# EAGLE design opbouw (EAGLE 6.3)
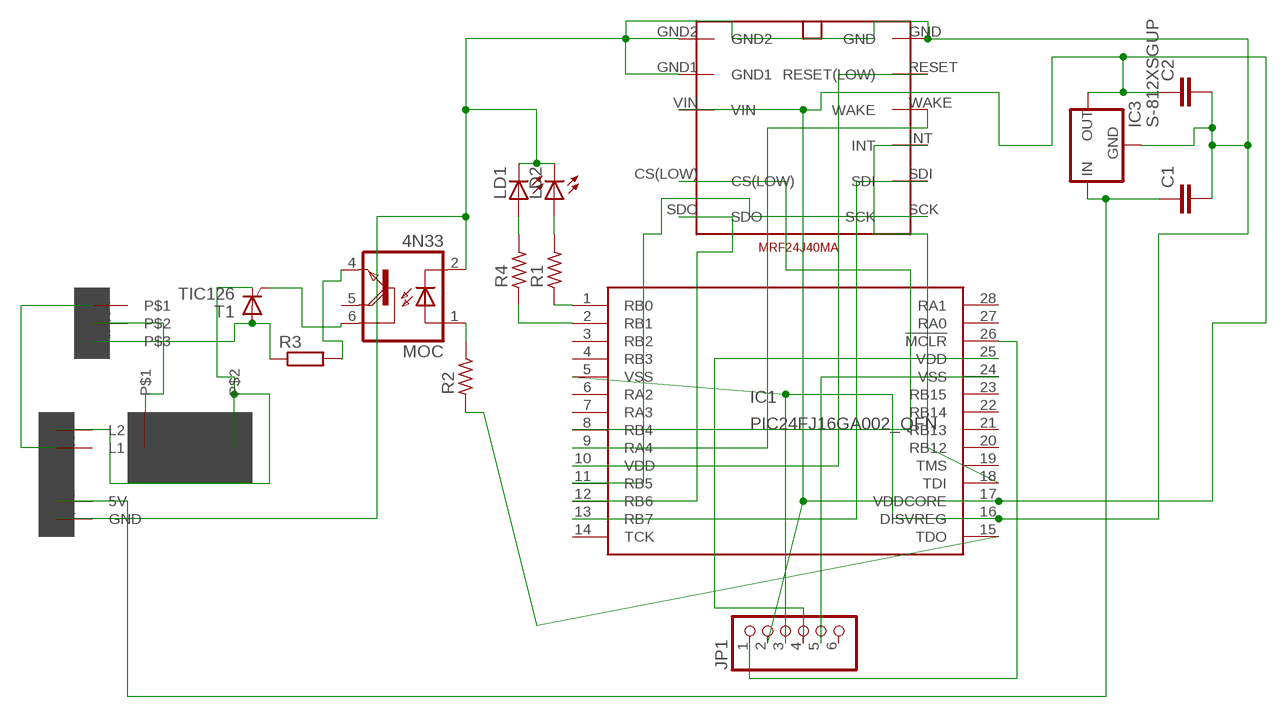
[diagram p0: schematic, sheet 1]

## Parts
C1  C-EUC0805K  [C0805K]
C2  C-EUC0805K  [C0805K]
IC1  PIC24FJ16GA002_QFN  [QFN28-ML_6X6MM]
IC3  S-812XSGUP  [SOT89]
JP1  PINHD-1X6  [1X06]
LD1  LEDCHIPLED_0805  [CHIPLED_0805]
LD2  LEDCHIPLED_0805  [CHIPLED_0805]
MOC  4N33  [DIL06]
R1  R_0805  [R0805]
R2  R_0805  [R0805]
R3  R-EU_0207/10  [0207/10]
R4  R_0805  [R0805]
T1  TIC126  [TO220CS]
U$1  MRF24J40MA  [MRF24J40MA]
U$2  CONNECTOR  [CONNECTOR]
U$3  FUSEFUSE  [FUSE]
U$4  BIAS  [BIAS]

## Nets
N$1: C2.1 IC1.17(VDDCORE) IC3.3(OUT) JP1.2 U$1.VIN
N$3: IC1.26(!MCLR) JP1.1
N$4: IC1.25(VDD) JP1.4
N$5: IC1.24(VSS) JP1.5
N$6: IC1.8(RB4) U$1.CS(LOW)
N$7: IC1.15(TDO) R2.1
N$8: IC1.10(VDD) U$1.RESET(RESET(LOW))
N$9: IC1.13(RB7) U$1.SDI
N$10: IC1.18(TDI) U$1.INT
N$11: IC1.9(RA4) U$1.WAKE
N$12: IC1.11(RB5) U$1.SCK
N$13: MOC.6(B) T1.G
N$14: MOC.1(A) R2.2
N$15: IC1.12(RB6) U$1.SDO
N$16: MOC.4(E) R3.2
N$17: U$2.P$2 U$3.P$1
N$18: R3.1 T1.A U$2.P$3
N$21: IC1.1(RB0) R1.1
N$22: IC1.2(RB1) R4.1
N$23: LD2.A R1.2
N$24: LD1.A R4.2
N$25: C1.2 C2.2 IC1.5(VSS) IC1.16(DISVREG) IC3.1(GND) JP1.3 LD1.C LD2.C MOC.2(C) U$1.GND U$1.GND1 U$1.GND2 U$4.P$4(GND)
N$28: C1.1 IC3.2(IN) U$4.P$3(5V)
N$32: T1.C U$3.P$2 U$4.P$1(L2)
N$34: U$2.P$1 U$4.P$2(L1)
Unconnected: IC1.3(RB2) IC1.4(RB3) IC1.6(RA2) IC1.7(RA3) IC1.14(TCK) IC1.19(TMS) IC1.20(RB12) IC1.21(RB13) IC1.22(RB14) IC1.23(RB15) IC1.27(RA0) IC1.28(RA1) JP1.6 MOC.5(COL)

## Library data of the parts
C1 C2 = rcl 2:C-EU: CAPACITOR, European symbol
IC1 = microchip:PIC24FJ16GA002_QFN: PIC24FJ16GA002_QFN edit this description Auto generated by make-symbol-device-package-bsdl.ulp Rev. 25 Source: PIC24FJ16GA002_QFN.bsd; MPN: PIC24FJ16GA002-I/ML; OC_FARNELL: unknown; OC_NEWARK: 40M1425
IC3 = v-reg-3:S-812XSG: Low power, low dropout positive regulator
JP1 = pinhead 2:PINHD-1X6: PIN HEADER
LD1 LD2 = led 2:LED: LED OSRAM: - CHIPLED LG R971, LG N971, LY N971, LG Q971, LY Q971, LO R971, LY R971 LH N974, LH R974 LS Q976, LO Q976, LY Q976 LO Q996 - Hyper CHIPLED LW Q18S LB Q993, LB Q99A, LB R99A - SideLED LS A670, LO A670, LY A670, LG A670, LP A670 LB A673, LV A673, LT A673, LW A673 LH A674 LY A675 LS A676, LA A676, LO A676, LY A676, LW A676 LS A679, LY A679, LG A679 - Hyper Micro SIDELED® LS Y876, LA Y876, LO Y876, LY Y876 LT Y87S - SmartLED LW L88C, LW L88S LB L89C, LB L89S, LG L890 LS L89K, LO L89K, LY L89K LS L896, LA L896, LO L896, LY L896 - TOPLED LS T670, LO T670, LY T670, LG T670, LP T670 LSG T670, LSP T670, LSY T670, LOP T670, LYG T670 LG T671, LOG T671, LSG T671 LB T673, LV T673, LT T673, LW T673 LH T674 LS T676, LA T676, LO T676, LY T676, LB T676, LH T676, LSB T676, LW T676 LB T67C, LV T67C, LT T67C, LS T67K, LO T67K, LY T67K, LW E67C LS E67B, LA E67B, LO E67B, LY E67B, LB E67C, LV E67C, LT E67C LW T67C LS T679, LY T679, LG T679 LS T770, LO T770, LY T770, LG T770, LP T770 LB T773, LV T773, LT T773, LW T773 LH T774 LS E675, LA E675, LY E675, LS T675 LS T776, LA T776, LO T776, LY T776, LB T776 LHGB T686 LT T68C, LB T68C - Hyper Mini TOPLED® LB M676 - Mini TOPLED Santana® LG M470 LS M47K, LO M47K, LY M47K Source: http://www.osram.convergy.de/
MOC = optocoupler:4N33: MOTOROLA OPTO COUPLER; MF: VISHAY/TELEFUNKEN; MPN: 4N33; OC_FARNELL: 1469601; OC_NEWARK: 88K1390
R1 R2 R4 = rc-master:R_: RESISTOR
R3 = rcl 2:R-EU_: RESISTOR, European symbol
T1 = triggered_devices:TIC126: THYRISTOR
U$1 = MRF24J40MA:MRF24J40MA
U$2 = connector7.5mm:CONNECTOR: connector 7.5mm
U$3 = fuse:FUSE
U$4 = bias:BIAS

## Board
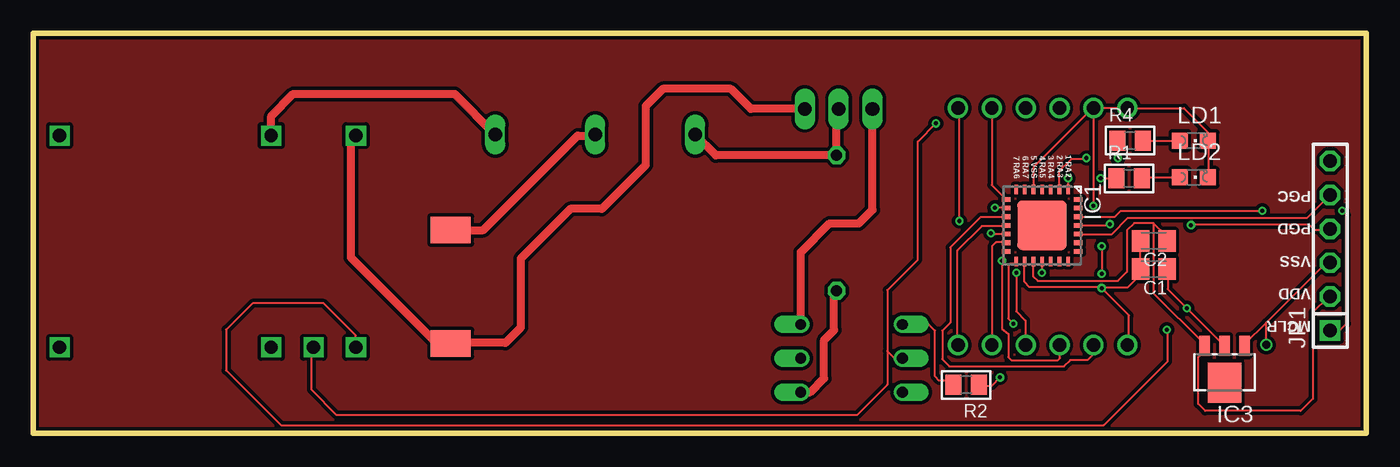
[diagram p1: board, top side]
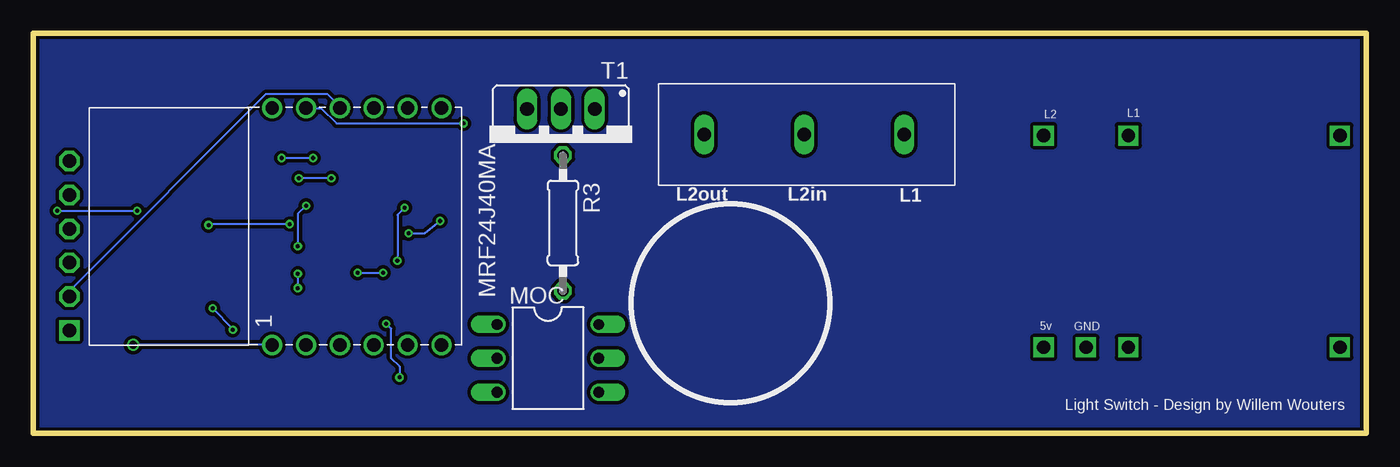
[diagram p2: board, bottom side, seen from below]

Size 100 x 30 mm. Coordinates in mm from the lower left corner, seen from the top.
Outline: 0,0 0,30 100,30 100,0 0,0
Copper layers (1*16): Top 0.035mm / dielectric 1.5mm / Bottom 0.035mm
Design rules "ITEADstudio_DRC": minimum track width 6mil, minimum drill 12mil, track to track 6mil, track to pad 6mil, pad to pad 6mil, via to via 6mil, smd to smd 0mil, copper to edge 10mil, drill to drill 10mil, minimum pad ring 10mil, minimum via ring 6mil, stop-mask expansion 2mil, vias tented up to drill 100mil, thermal gap 10mil

### Footprints (pad centres in the part's own frame; a part is rotated, then mirrored left to right if it is on the bottom)
C0805K = smd 1.3 x 1.6: 1 -1,0; 2 1,0
QFN28-ML_6X6MM = smd 0.7 x 0.35: 1 -2.7,1.95; 2 -2.7,1.3; 3 -2.7,0.65; 4 -2.7,0; 5 -2.7,-0.65; 6 -2.7,-1.3; 7 -2.7,-1.95; 15 2.7,-1.95; 16 2.7,-1.3; 17 2.7,-0.65; 18 2.7,0; 19 2.7,0.65; 20 2.7,1.3; 21 2.7,1.95 | smd 0.35 x 0.7: 8 -1.95,-2.7; 9 -1.3,-2.7; 10 -0.65,-2.7; 11 0,-2.7; 12 0.65,-2.7; 13 1.3,-2.7; 14 1.95,-2.7; 22 1.95,2.7; 23 1.3,2.7; 24 0.65,2.7; 25 0,2.7; 26 -0.65,2.7; 27 -1.3,2.7; 28 -1.95,2.7 | smd 3.7 x 3.7: EXP 0,0
SOT89 = smd 0.8 x 1.5: 1 -1.5,-1.75; 2 0,-1.75; 3 1.5,-1.75 | smd 2.5 x 3: 4 0,1.05
1X06 = drill 1.016 square: 1 -6.35,0 | drill 1.016 octagon: 2 -3.81,0; 3 -1.27,0; 4 1.27,0; 5 3.81,0; 6 6.35,0
CHIPLED_0805 = smd 1.2 x 1.2: A 0,-1.05; C 0,1.05
DIL06 = drill 0.813 offset: 1 -2.54,-3.81; 2 0,-3.81; 3 2.54,-3.81; 4 2.54,3.81; 5 0,3.81; 6 -2.54,3.81
R0805 = smd 1.2 x 1.5: 1 -0.953,0; 2 0.953,0
0207/10 = drill 0.813 octagon: 1 -5.08,0; 2 5.08,0
TO220CS = drill 1.016 long: A 0,-2.54; C -2.54,-2.54; G 2.54,-2.54
MRF24J40MA = drill 1: CS(LOW) 16.764,4.064; GND -1.016,14.224; GND1 16.764,11.684; GND2 16.764,14.224; INT -1.016,6.604; NC 16.764,6.604; RESET -1.016,11.684; SCK -1.016,1.524; SDI -1.016,4.064; SDO 16.764,1.524; VIN 16.764,9.144; WAKE -1.016,9.144
CONNECTOR = drill 1 long: P$1 0,0; P$2 7.5,0; P$3 15,0
FUSE = smd 2 x 3: P$1 -1,0; P$2 7.5,0
BIAS = drill 1 square: P$1 22.225,0; P$2 15.875,0; P$3 22.225,15.875; P$4 19.05,15.875; P$5 15.875,15.875; P$8 0,15.875; P$99 0,0

### Placement (x,y rotation side)
C1  84.06,12.31 180 top
C2  84.06,14.43 180 top
IC1  75.68,15.6 270 top
IC3  89.36,4.84 180 top
JP1  97.3,14.07 90 top
LD1  87.09,21.95 270 top
LD2  87.09,19.2 270 top
MOC  61.38,5.63 270 bottom
R1  82.21,19.13 0 top
R2  70,3.63 180 top
R3  60.26,15.77 270 bottom
R4  82.29,21.95 0 top
T1  60.42,21.79 180 bottom
U$1  67.85,7.64 90 bottom
U$2  34.66,22.4 0 top
U$3  31.31,14.25 270 top
U$4  1.97,22.33 180 bottom

### Tracks (layer width: path | path; a pad name or v marks a point on that pad's centre or on a via)
N$1
  Top 0.152: 84.04,15.77 82.59,15.77 82.06,15.24 82.06,12.12 81.37,11.43 75.35,11.43 75.05,11.73 75.05,12.8 IC1.17 | 84.04,15.77 84.95,14.86 C2.1 | 84.04,15.77 84.04,10.52 87.85,6.71 IC3.3 | 87.85,6.55 IC3.3 | JP1.2 97.15,10.21 96,9.07 96,2.59 95.09,1.68 87.92,1.68 87.39,2.21 87.39,5.71 87.77,6.1 87.77,6.5 IC3.3
  Bottom 0.152: U$1.VIN 77.03,24.54 77.94,25.45 82.52,25.45 97.15,10.82 97.15,10.36 JP1.2
N$3  (via drill 0.3)
  Top 0.152: IC1.26 78.4,16.23 81.14,16.23 81.6,16.69 92.27,16.69 92.19,16.61 v92.19,16.69 | v98.21,16.69 98.52,16.38 98.52,8.23 97.98,7.7 97.37,7.7 97.3,7.77 JP1.1
  Bottom 0.152: v98.21,16.69 v92.19,16.69
N$4  (via drill 0.3)
  Top 0.152: v86.86,15.62 86.86,15.7 95.7,15.7 96.16,15.24 97.3,15.24 97.3,15.32 JP1.4 | v80.76,15.7 80.53,15.62 78.4,15.62 IC1.25
  Bottom 0.152: v86.86,15.62 86.94,15.7 v80.76,15.7
N$5
  Top 0.152: IC1.24 80.92,14.95 82.13,16.15 95.57,16.15 JP1.5
N$6
  Top 0.152: U$1.CS(LOW) 71.92,18.61 IC1.8
N$7  (via drill 0.3)
  Top 0.152: v72.53,4.19 71.92,3.58 70.7,3.58 | v73.52,8.23 73.14,8.61 73.14,12.57 73.3,12.72 73.68,12.72 73.75,12.88 IC1.15 | 70.7,3.58 70.55,3.58 | 70.7,3.58 R2.1
  Bottom 0.152: v72.53,4.19 72.53,5.03 73.14,5.64 73.14,7.85 v73.52,8.23
N$8
  Top 0.152: 79.54,6.55 U$1.RESET 79.47,6.55 79.47,5.87 79.09,5.49 77.79,5.49 77.33,5.03 68.72,5.03 68.19,5.56 68.19,7.7 68.8,8.31 68.8,13.95 71.08,16.23 72.97,16.23 IC1.10 72.91,16.23
N$9
  Top 0.152: U$1.SDI 71.92,7.77 71.92,14.02 72.23,14.33 72.84,14.33 IC1.13
N$10  (via drill 0.3)
  Top 0.152: v73.75,12.04 73.75,9.14 74.44,8.46 74.44,6.64 U$1.INT | 75.66,12.8 v75.66,12.04
  Top 0.254: 75.66,12.8 IC1.18
  Bottom 0.152: v75.66,12.04 v73.75,12.04
N$11  (via drill 0.3)
  Top 0.152: v72.69,12.95 72.69,7.85 73.14,7.47 73.14,5.71 73.37,5.49 76.88,5.49 77.03,5.64 77.03,6.55 U$1.WAKE | v72.15,16.92 72.91,16.92 IC1.9
  Bottom 0.152: v72.69,12.95 72.69,16.38 v72.15,16.92
N$12
  Top 0.152: U$1.SCK 69.33,7.09 69.33,13.72 71.16,15.54 72.84,15.54 IC1.11
N$13
  Top 0.61: MOC.6 57.58,13.59 59.73,15.75 61.94,15.75 62.96,16.76 T1.G
N$14
  Top 0.152: R2.2 68.95,3.5 68.72,3.96 67.96,3.96 67.66,4.27 67.66,7.7 67.12,8.23 65.21,8.23 MOC.1
N$15  (via drill 0.3)
  Top 0.152: v71.85,15.01 71.92,14.94 72.91,14.94 IC1.12 | 69.41,24.38 U$1.SDO 69.48,24.3 v69.48,15.93
  Bottom 0.152: v69.48,15.93 70.63,15.01 v71.85,15.01
N$16
  Top 0.61: MOC.4 58.3,3.09 59.33,4.12 59.33,6.99 60.09,7.75 60.09,10.44 R3.2
N$17
  Top 0.61: U$3.P$1 33.76,15.25 40.83,22.33 42.09,22.33 U$2.P$2
N$18
  Top 0.61: T1.A 60.27,24.18 R3.1 51.21,20.85 U$2.P$3
N$20
  pour Bottom (isolate 0.254): 0,30 100,30 100,0 0,0
N$21  (via drill 0.3)
  Top 0.152: v80.08,19.13 R1.1 | v77.64,19.13 77.64,18.36 IC1.1
  Bottom 0.152: v77.64,19.13 v80.08,19.13
N$22  (via drill 0.3)
  Top 0.152: 76.95,18.36 IC1.2 76.95,18.32 76.95,19.66 77.87,20.57 79.01,20.57 v79.01,20.65 | v81.37,20.65 81.37,21.95 R4.1
  Bottom 0.152: v81.37,20.65 v79.01,20.65
N$23
  Top 0.152: LD2.A 83.2,19.2 83.2,19.13 R1.2
N$24
  Top 0.152: LD1.A 83.35,21.95 83.28,22.02 83.2,21.95 R4.2
N$25  (via drill 0.3, 0.6)
  Top 0.152: U$1.GND1 U$1.GND2 82.06,24.38 86.33,24.38 88.08,22.63 88.08,22 LD1.C | C2.2 C1.2 82.97,12.19 82.74,11.58 82.13,10.97 80.15,10.97 | v67.73,23.24 66.36,21.87 66.36,13.03 64.08,10.74 64.08,6.17 | 92.5,8.31 96.84,12.65 97.15,12.65 97.22,12.72 JP1.3 | 92.5,8.31 90.9,6.71 IC3.1 | IC1.5 75.05,18.44 75.05,19.96 79.47,24.38 U$1.GND1 | 82.21,6.71 82.74,6.71 | 82.21,6.71 U$1.GND | 80.15,10.97 74.74,10.97 74.36,11.35 74.36,12.65 74.44,12.8 IC1.16 | 64.08,6.17 64.08,3.66 61.79,1.37 22.77,1.37 20.87,3.28 20.87,6.3 U$4.P$4 | v79.54,17.07 79.54,24.38 U$1.GND1 | 80.15,10.97 v80.15,10.9 82.21,8.84 82.21,6.71 | v80.15,14.02 v80.15,11.96 | LD2.C 88.15,19.2 88.15,21.95 LD1.C | 88,22.02 88.08,21.95 LD1.C | v92.5,6.63 92.5,8.31 | MOC.2 64.62,5.63 64.08,6.17
  Bottom 0.152: v67.73,23.24 77.26,23.24 78.4,24.38 79.47,24.38 U$1.GND1 | 82.21,6.71 U$1.GND 82.21,6.63 v92.5,6.63 | v80.15,14.02 80.15,16.46 v79.54,17.07 | v80.15,11.96 v80.15,10.9
N$26
  pour Top (isolate 0.254): 0,30 100,30 100,0 0,0
N$28  (via drill 0.3)
  Top 0.152: IC3.2 89.22,6.71 v86.55,9.37 85.11,10.82 85.11,12.19 C1.1 | U$4.P$3 24.2,7.34 21.78,9.75 16.45,9.75 14.47,7.77 14.47,4.72 18.58,0.61 80.31,0.61 85.11,5.41 85.11,7.7 v85.03,7.77
  Bottom 0.152: v85.03,7.77 85.03,7.85 v86.55,9.37
N$32
  Top 0.61: T1.C 53.84,24.33 52.34,25.83 47.23,25.83 45.94,24.54 45.94,20.12 42.66,16.84 40.3,16.84 36.57,13.11 36.57,7.92 35.42,6.78 31.34,6.78 U$3.P$2 30.27,6.75 23.84,13.18 23.84,21.97 U$4.P$1
N$34
  Top 0.61: U$4.P$2 17.85,23.8 19.5,25.45 31.61,25.45 U$2.P$1

### Text on the board
tPlace: 1 RA2 / 2 RA3 / 3 RA4 / 4 RA5 / 5 VSS / 6 RA7 / 7 RA6 | MCLR / / VDD / / VSS / / PGD / / PGC
bPlace: L1 | L2in | L2out | Light Switch - Design by Willem Wouters